# Altium schematic sheet ELRS Logic.SchDoc
size A3; SheetNumber: 2; SheetTotal: 2; SPICEModelCacheXGBCKONE: <root> / <DocumentId>XGBCKONE</DocumentId> / <CacheFrame Number="0"> / <Model Name="0603_885012106031_10uf" Kind="CKT"> / <Text>******* / .subckt 0603_885012106031_10uF 1 2 / Rser 1 3 0.0105 / Lser 2 4 0.0000000008 / C1 3 4 0.00001 / Rpar 3 4 10000000 / .ends 0603_885012106031_10uF</Text> / </Model> / </CacheFrame> / </root>
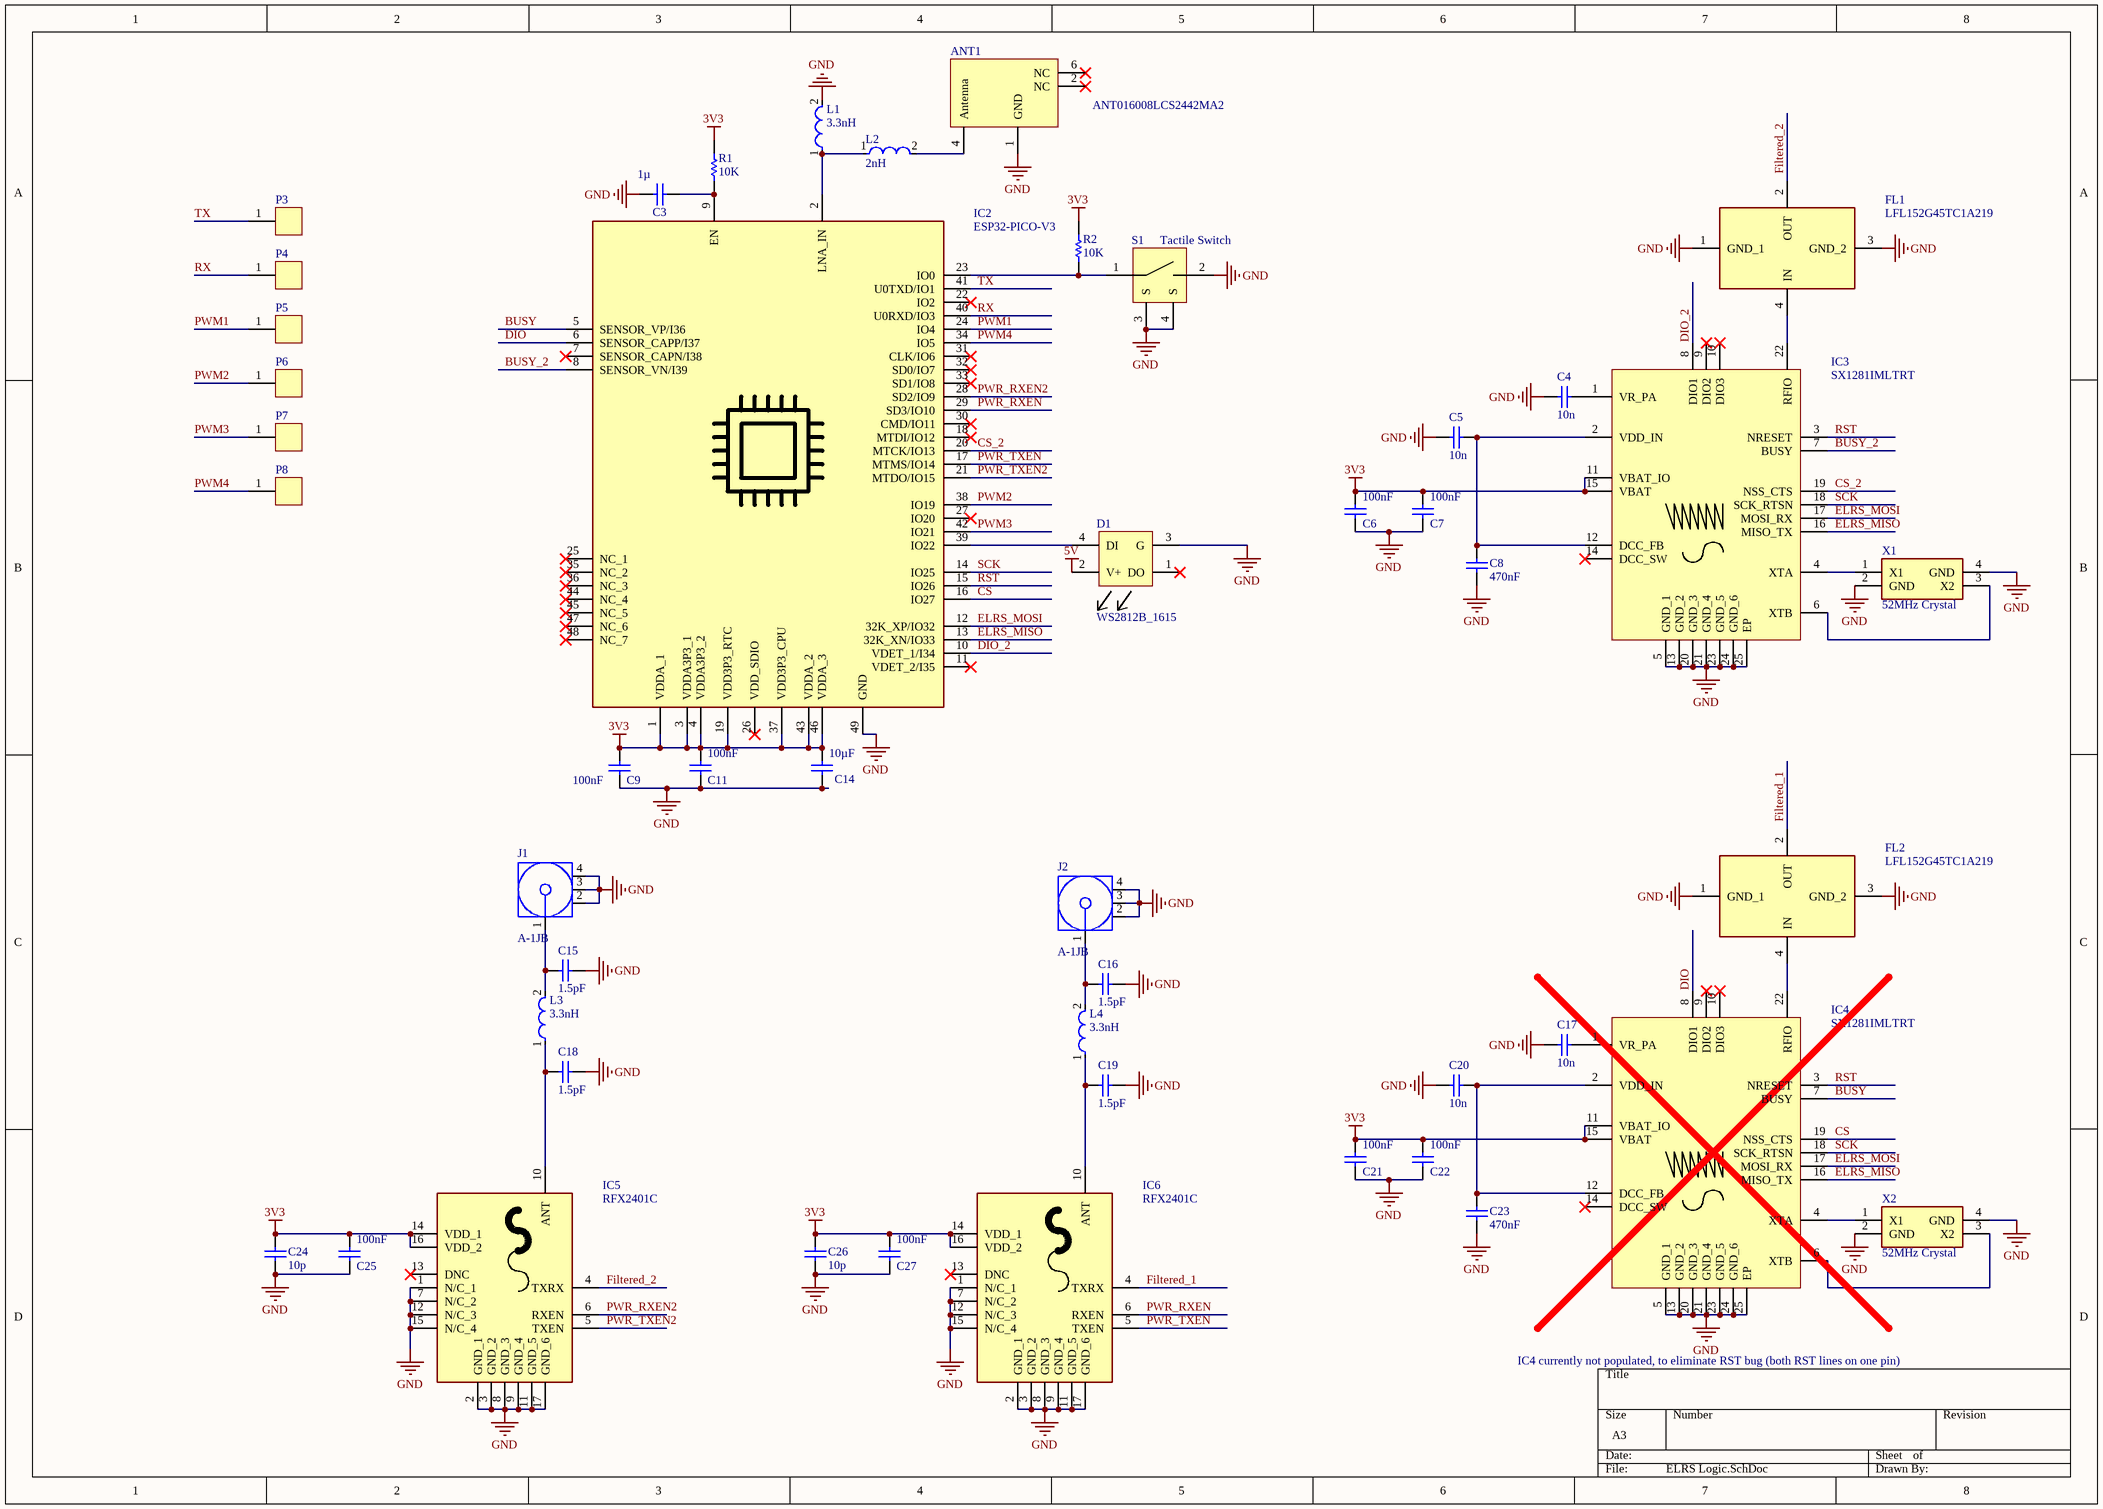
[diagram p0: ELRS Logic.SchDoc]

## Parts
ANT1  ANT016008LCS2442MA2  [ANT016008LCS2442MA2]
C3  1µ  [WCAP-CSGP_0603_L1.6W0.8H0.8_Reflow]
C4  10n  [CAPC0603(1608)55_N]
C5  10n  [CAPC0603(1608)55_N]
C6  100nF  [WCAP-CSGP_0603_L1.6W0.8H0.8_Reflow]
C7  100nF  [WCAP-CSGP_0603_L1.6W0.8H0.8_Reflow]
C8  470nF  [0402 cap]
C9  100nF  [WCAP-CSGP_0603_L1.6W0.8H0.8_Reflow]
C11  100nF  [WCAP-CSGP_0603_L1.6W0.8H0.8_Reflow]
C14  10µF  [WCAP-CSGP_0603_L1.6W0.8H0.8_Reflow]
C15  1.5pF  [0402 cap]
C16  1.5pF  [0402 cap]
C17  10n  [CAPC0603(1608)55_N]
C18  1.5pF  [0402 cap]
C19  1.5pF  [0402 cap]
C20  10n  [CAPC0603(1608)55_N]
C21  100nF  [WCAP-CSGP_0603_L1.6W0.8H0.8_Reflow]
C22  100nF  [WCAP-CSGP_0603_L1.6W0.8H0.8_Reflow]
C23  470nF  [0402 cap]
C24  10p  [0402 cap]
C25  100nF  [WCAP-CSGP_0603_L1.6W0.8H0.8_Reflow]
C26  10p  [0402 cap]
C27  100nF  [WCAP-CSGP_0603_L1.6W0.8H0.8_Reflow]
D1  WS2812B_1615  [WS2812B_1615]
FL1  LFL152G45TC1A219  [LFL152G45TC1A219]
FL2  LFL152G45TC1A219  [LFL152G45TC1A219]
IC2  ESP32-PICO-V3  [ESP32PICOV3]
IC3  SX1281IMLTRT  [QFN50P400X400X100-25N-D]
IC4  SX1281IMLTRT  [QFN50P400X400X100-25N-D]
IC5  RFX2401C  [QFN50P300X300X60-17N-D]
IC6  RFX2401C  [QFN50P300X300X60-17N-D]
J1  A-1JB  [AMPH-A-1JB_V]
J2  A-1JB  [AMPH-A-1JB_V]
L1  3.3nH  [FP-LQW15AN_00-W0_6-0_1-MFG]
L2  2nH  [FP-LQW15AN_00-W0_6-0_1-MFG]
L3  3.3nH  [FP-LQW15AN_00-W0_6-0_1-MFG]
L4  3.3nH  [FP-LQW15AN_00-W0_6-0_1-MFG]
P3  solder pad rounded single sided  [solder pad single sided rounded]  (value not drawn)
P4  solder pad rounded single sided  [solder pad single sided rounded]  (value not drawn)
P5  solder pad rounded single sided  [solder pad single sided rounded]  (value not drawn)
P6  solder pad rounded single sided  [solder pad single sided rounded]  (value not drawn)
P7  solder pad rounded single sided  [solder pad single sided rounded]  (value not drawn)
P8  solder pad rounded single sided  [solder pad single sided rounded]  (value not drawn)
R1  10K  [RESC0603(1608)_N]
R2  10K  [RESC0603(1608)_N]
S1  Tactile Switch  [Tactile Switch]
X1  52MHz Crystal  [2016 Crystal]
X2  52MHz Crystal  [2016 Crystal]

## Nets
3V3: C6.2 C7.2 C9.2 C11.2 C14.2 C21.2 C22.2 C24.2 C25.2 C26.2 C27.2 IC2.1(VDDA_1) IC2.3(VDDA3P3_1) IC2.4(VDDA3P3_2) IC2.19(VDD3P3_RTC) IC2.37(VDD3P3_CPU) IC2.43(VDDA_2) IC2.46(VDDA_3) IC3.11(VBAT_IO) IC3.15(VBAT) IC4.11(VBAT_IO) IC4.15(VBAT) IC5.14(VDD_1) IC5.16(VDD_2) IC6.14(VDD_1) IC6.16(VDD_2) R1.2 R2.2
5V: D1.2(V+)
GND: ANT1.1(GND) C3.2 C4.1 C5.1 C6.1 C7.1 C8.1 C9.1 C11.1 C14.1 C15.2 C16.2 C17.1 C18.2 C19.2 C20.1 C21.1 C22.1 C23.1 C24.1 C25.1 C26.1 C27.1 D1.3(G) FL1.1(GND_1) FL1.3(GND_2) FL2.1(GND_1) FL2.3(GND_2) IC2.49(GND) IC3.5(GND_1) IC3.13(GND_2) IC3.20(GND_3) IC3.21(GND_4) IC3.23(GND_5) IC3.24(GND_6) IC3.25(EP) IC4.5(GND_1) IC4.13(GND_2) IC4.20(GND_3) IC4.21(GND_4) IC4.23(GND_5) IC4.24(GND_6) IC4.25(EP) IC5.1(N/C_1) IC5.2(GND_1) IC5.3(GND_2) IC5.7(N/C_2) IC5.8(GND_3) IC5.9(GND_4) IC5.11(GND_5) IC5.12(N/C_3) IC5.15(N/C_4) IC5.17(GND_6) IC6.1(N/C_1) IC6.2(GND_1) IC6.3(GND_2) IC6.7(N/C_2) IC6.8(GND_3) IC6.9(GND_4) IC6.11(GND_5) IC6.12(N/C_3) IC6.15(N/C_4) IC6.17(GND_6) J1.2 J1.3 J1.4 J2.2 J2.3 J2.4 L1.2 S1.2 S1.3(S) S1.4(S) X1.2(GND) X1.4(GND) X2.2(GND) X2.4(GND)
BUSY: IC2.5(SENSOR_VP/I36) IC4.7(BUSY)
BUSY_2: IC2.8(SENSOR_VN/I39) IC3.7(BUSY)
CS: IC2.16(IO27) IC4.19(NSS_CTS)
CS_2: IC2.20(MTCK/IO13) IC3.19(NSS_CTS)
DIO: IC2.6(SENSOR_CAPP/I37) IC4.8(DIO1)
DIO_2: IC2.10(VDET_1/I34) IC3.8(DIO1)
ELRS_MISO: IC2.13(32K_XN/IO33) IC3.16(MISO_TX) IC4.16(MISO_TX)
ELRS_MOSI: IC2.12(32K_XP/IO32) IC3.17(MOSI_RX) IC4.17(MOSI_RX)
Filtered_1: FL2.2(OUT) IC6.4(TXRX)
Filtered_2: FL1.2(OUT) IC5.4(TXRX)
PWM1: IC2.24(IO4) P5.1(upper)
PWM2: IC2.38(IO19) P6.1(upper)
PWM3: IC2.42(IO21) P7.1(upper)
PWM4: IC2.34(IO5) P8.1(upper)
PWR_RXEN: IC2.29(SD3/IO10) IC6.6(RXEN)
PWR_RXEN2: IC2.28(SD2/IO9) IC5.6(RXEN)
PWR_TXEN: IC2.17(MTMS/IO14) IC6.5(TXEN)
PWR_TXEN2: IC2.21(MTDO/IO15) IC5.5(TXEN)
RST: IC2.15(IO26) IC3.3(NRESET) IC4.3(NRESET)
RX: IC2.40(U0RXD/IO3) P4.1(upper)
SCK: IC2.14(IO25) IC3.18(SCK_RTSN) IC4.18(SCK_RTSN)
TX: IC2.41(U0TXD/IO1) P3.1(upper)
NetANT1_4: ANT1.4(Antenna) L2.2
NetC3_1: C3.1 IC2.9(EN) R1.1
NetC4_2: C4.2 IC3.1(VR_PA)
NetC5_2: C5.2 C8.2 IC3.2(VDD_IN) IC3.12(DCC_FB)
NetC15_1: C15.1 J1.1 L3.2
NetC16_1: C16.1 J2.1 L4.2
NetC17_2: C17.2 IC4.1(VR_PA)
NetC18_1: C18.1 IC5.10(ANT) L3.1
NetC19_1: C19.1 IC6.10(ANT) L4.1
NetC20_2: C20.2 C23.2 IC4.2(VDD_IN) IC4.12(DCC_FB)
NetD1_4: D1.4(DI) IC2.39(IO22)
NetFL1_4: FL1.4(IN) IC3.22(RFIO)
NetFL2_4: FL2.4(IN) IC4.22(RFIO)
NetIC2_2: IC2.2(LNA_IN) L1.1 L2.1
NetIC2_23: IC2.23(IO0) R2.1 S1.1
NetIC3_4: IC3.4(XTA) X1.1(X1)
NetIC3_6: IC3.6(XTB) X1.3(X2)
NetIC4_4: IC4.4(XTA) X2.1(X1)
NetIC4_6: IC4.6(XTB) X2.3(X2)

Not connected (* = marked no-connect by the designer): ANT1 2(NC)* 6(NC)*; D1 1(DO)*; IC2 7(SENSOR_CAPN/I38)* 11(VDET_2/I35)* 18(MTDI/IO12)* 22(IO2)* 25(NC_1)* 26(VDD_SDIO)* 27(IO20)* 30(CMD/IO11)* 31(CLK/IO6)* 32(SD0/IO7)* 33(SD1/IO8)* 35(NC_2)* 36(NC_3)* 44(NC_4)* 45(NC_5)* 47(NC_6)* 48(NC_7)*; IC3 9(DIO2)* 10(DIO3)* 14(DCC_SW)*; IC4 9(DIO2)* 10(DIO3)* 14(DCC_SW)*; IC5 13(DNC)*; IC6 13(DNC)*

## Notes on the sheet
- IC4 currently not populated, to eliminate RST bug (both RST lines on one pin)

## Library data of the parts
ANT1 = ANT016008LCS2442MA2: Antenna; Manufacturer_Name: TDK; Datasheet Link: https://product.tdk.com/system/files/dam/doc/product/rf/rf/antenna/catalog/rf_ant_ant016008lcs2442ma2_summary_en.pdf; Height: 0.4mm; Manufacturer_Part_Number: ANT016008LCS2442MA2; Mouser Part Number: 810-ANT168LCS2442MA2; Mouser Price/Stock: https://www.mouser.co.uk/ProductDetail/TDK/ANT016008LCS2442MA2?qs=NlTBjZZh8j0h3jcBIFCiDg%3D%3D; Arrow Part Number: ANT016008LCS2442MA2; Arrow Price/Stock: https://www.arrow.com/en/products/ant016008lcs2442ma2/tdk
C3 C6 C7 C9 C11 C21 C22 C25 C27 = 885012206095: WCAP-CSGP Multilayer Ceramic Chip Capacitor, General Purpose, size 0603, X7R, 100nF, 50VDC; Manufacturer: Wurth Elektronik; Case/Size Code: 0603; Capacitance Tolerance: +/-10%; Dissipation Factor: 3%; Insulation Resistance: 5GΩ; Rated Voltage (DC): 50V; Technical Reference: X7R0603104K050DFCT10000; Manufacturer Part Number: 885012206095; Category: Multilayer Ceramic Chip Capacitors; Match Code: WCAP-CSGP; ComponentLink1Description: Website Link; ComponentLink1URL: https://www.we-online.com/redexpert/article/885012206095?ad; ComponentLink2Description: Datasheet Link; ComponentLink2URL: https://www.we-online.com/redexpert/spec/885012206095?ad; Mount: Surface Mount; Operating Temperature Max: 125°C; Operating Temperature Min: -55°C; Packaging: Tape and Reel; Length: 1.6mm; Width: 0.8mm; Height: 0.8mm; Capacitance: 100nF; Ceramic Type: X7R
C4 C5 C17 C20 = Cap 10n: Keramikvielschichtkondensator, SMD, Baureihe MC, ± 20%; Manufacturer: Multicomp; OC_FARNELL: 1759022; Value: 10n; PackageReference: 0603
C8 C23 C24 C26 = Capacitor 0402 100nF
  C8 C23: Value: 470nF
  C24 C26: Value: 10p
C14 = 885012106031: WCAP-CSGP Multilayer Ceramic Chip Capacitor, General Purpose, size 0603, X5R, 10µF, 25VDC; Manufacturer: Wurth Elektronik; Case/Size Code: 0603; Capacitance Tolerance: +/20%; Dissipation Factor: 20%; Insulation Resistance: 0.01GΩ; Rated Voltage (DC): 25V; Technical Reference: X5R0603106M025DFCT10000; Manufacturer Part Number: 885012106031; Category: Multilayer Ceramic Chip Capacitors; Match Code: WCAP-CSGP; ComponentLink1Description: Website Link; ComponentLink1URL: https://www.we-online.com/redexpert/article/885012106031?ad; ComponentLink2Description: Datasheet Link; ComponentLink2URL: https://www.we-online.com/redexpert/spec/885012106031?ad; Mount: Surface Mount; Operating Temperature Max: 85°C; Operating Temperature Min: -55°C; Packaging: Tape and Reel; Length: 1.6mm; Width: 0.8mm; Height: 0.8mm; Capacitance: 10µF; Ceramic Type: X5R
C15 C16 C18 C19 = Capacitor 0402 100nF: CL05C1R5BB5NNNC; Value: 1.5pF
D1 = WS2812B_1615: XINGLIGHT XL-1615RGBC-WS2812B
FL1 FL2 = LFL152G45TC1A219: Filter; Manufacturer_Name: Murata Electronics; Datasheet Link: https://www.murata.com/en-us/products/productdetail?partno=LFL152G45TC1A219; Height: 0.4mm; Manufacturer_Part_Number: LFL152G45TC1A219; Mouser Part Number: 81-LFL152G45TC1A219; Mouser Price/Stock: https://www.mouser.co.uk/ProductDetail/Murata-Electronics/LFL152G45TC1A219?qs=%2F%252BYoplLUB5hWhU%2FZs0btqg%3D%3D; Arrow Part Number: LFL152G45TC1A219; Arrow Price/Stock: https://www.arrow.com/en/products/lfl152g45tc1a219/murata-manufacturing?region=nac
IC2 = ESP32-PICO-V3: Integrated Circuit; Manufacturer_Name: Espressif Systems; Datasheet Link: https://kr.mouser.com/datasheet/2/891/esp32-pico-v3_datasheet_en-1842685.pdf; Height: 1.04mm; Manufacturer_Part_Number: ESP32-PICO-V3; Mouser Part Number: 356-ESP32-PICO-V3; Mouser Price/Stock: https://www.mouser.co.uk/ProductDetail/Espressif-Systems/ESP32-PICO-V3?qs=GBLSl2Akirs311o8knsnZA%3D%3D
IC3 IC4 = SX1281IMLTRT: Integrated Circuit; Manufacturer_Name: SEMTECH; Datasheet Link: https://www.arrow.com/en/products/sx1281imltrt/semtech; Height: 1mm; Manufacturer_Part_Number: SX1281IMLTRT; Mouser Part Number: 947-SX1281IMLTRT; Mouser Price/Stock: https://www.mouser.co.uk/ProductDetail/Semtech/SX1281IMLTRT?qs=5aG0NVq1C4xR1aFoShVcjg%3D%3D; Arrow Part Number: SX1281IMLTRT; Arrow Price/Stock: https://www.arrow.com/en/products/sx1281imltrt/semtech?region=nac
IC5 IC6 = RFX2401C: Integrated Circuit; Manufacturer_Name: Skyworks; Datasheet Link: https://eu.mouser.com/datasheet/2/472/RFX2401C_204359B-1524606.pdf; Height: 0.6mm; Manufacturer_Part_Number: RFX2401C; Mouser Part Number: 477-RFX2401C; Mouser Price/Stock: https://www.mouser.co.uk/ProductDetail/Skyworks-Solutions-Inc/RFX2401C?qs=dBWc1juS%252B3ydEXrKsuxQ7A%3D%3D
J1 J2 = CMP-1743-00001-1: AMC PCB Jack, 0 to 60 GHz, 60 V, -40 to 90 degC, 4-Pin SMD, RoHS, Tape and Reel; Capacitance: 100 uF; Case\Package: 2917; Voltage Rating (DC): 10 V; ESR: 700 mohm; Tolerance: 10%; ComponentLink1Description: Datasheet; PackageDescription: 4-Pin Surface Mount Device, Body 2.6 x 2.6 mm; Radiation Hardening: No; Package Quantity: 1; REACH SVHC: No SVHC; DatasheetVersion: Rev. K, 05/2016; ComponentLink1URL: http://drawings.amphenolrf.com/Customer_Outline/CA-1JB.pdf; Pins: 2; Packaging: Tape and Reel; Min Operating Temperature: -55 degC; RoHSCompliant: true; Length: 7.3 mm; PackageReference: A-1JB; Weight: 0.023634 oz; Mount: Surface Mount; Voltage Rating: 10 V; Max Operating Temperature: 125 degC; Height: 3.1 mm; Case Code (Imperial): 2917; Case Code (Metric): 7343; Width: 4.3 mm
L1-L4 = CMP-06042-000827-1: MLG1005S3N3BT000; Inductance: 3.9nH; Shielding: Unshielded; Self Resonant Frequency: 10GHz; Core Material: Air; Current: 750mA; Test Frequency: 100MHz; DC Resistance (DCR): 70mR; Length: 1mm; Height: 0.5mm; Case Code (Metric): 1005; Lead Free: Lead Free; Military Standard: Not; Mount: Surface Mount; REACH SVHC: No SVHC; Current Rating: 750mA; DC Current: 750mA; Max Operating Temperature: 125°C; Package Quantity: 10000; Packaging: Tape and Reel; Case/Package: 0402; Min Operating Temperature: -55°C; Width: 0.02inch; Depth: 0.7mm; Termination: SMD/SMT; Weight: 2.8E-05oz; Number of Pins: 2; Radiation Hardening: No; Max DC Current: 750mA; Case Code (Imperial): 0402
R1 = Res 1K: Chipwiderstand, SMD, Baureihe MC, 1%; Manufacturer: Multicomp; Value: 1K; PackageReference: 0603; OC_FARNELL: 9330380
R2 = Res 10K: Chipwiderstand, SMD, Baureihe MC, 1%; Manufacturer: Multicomp; PackageReference: 0603; Value: 10K; OC_FARNELL: 9330399
X1 X2 = HCI XC21M4-52.000: HCI XC21M4-52.000-F10NNHPL